# EAGLE design FMBTECH (EAGLE 8.5.0)
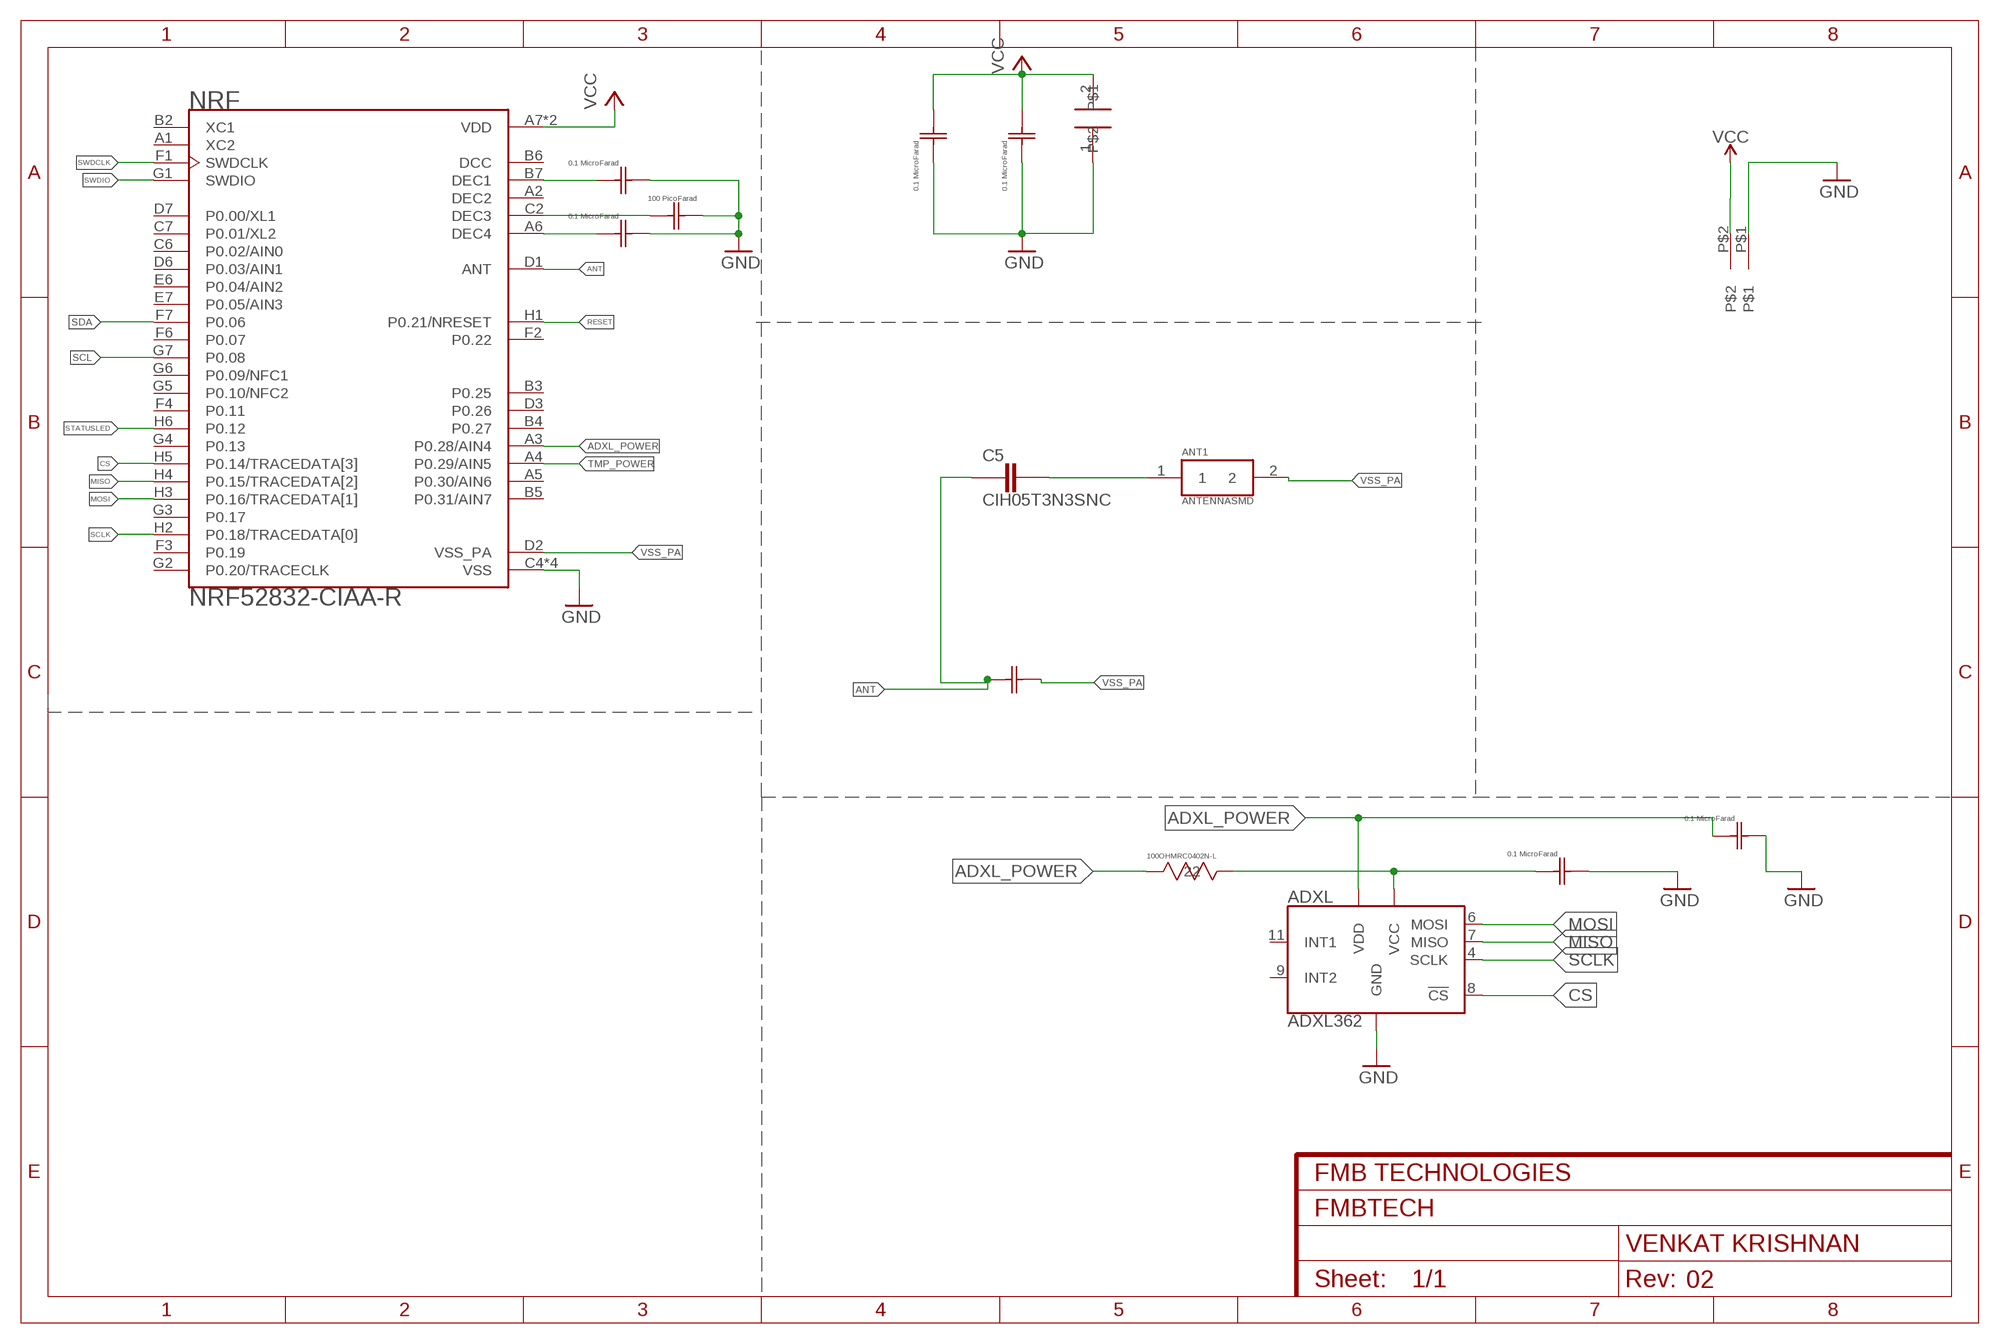
[diagram p0: schematic, sheet 1]

## Parts
ADXL  ADXL362  [TFLGA-16/3.3MMX3.1MM]
ANT1  ANTENNASMD  [1]
C1  02016D104KAT2A  [0201]
C2  02016D104KAT2A  [0201]
C3  GRM0335C1E101JA01D  [G-033]
C4  GJM1555C1H1R0BB01DG-155-L  [G-155-L]
C5  CIH05T3N3SNC  [CAPC1005X55N]
C6  02016D104KAT2A  [0201]
C7  02016D104KAT2A  [0201]
C8  02016D104KAT2A  [0201]
C9  02016D104KAT2A  [0201]
NRF  NRF52832-CIAA-R  [BGA50N40P7X8_300X320X40]
R6  100OHMRC0402N-L  [RES]
U$1  4.7µF  [CAP]
U$4  SUPPLY  [SUPPLY]

## Nets
ADXL_POWER: ADXL.1(VDD) C9.1 NRF.A3(P0.28/AIN4) R6.1
ANT: C4.1 C5.1 NRF.D1(ANT)
CS: ADXL.8(!CS) NRF.H5(P0.14/TRACEDATA[3])
GND: ADXL.12(GND) ADXL.13(GND) ADXL.16(GND) C1.2 C2.2 C3.2 C6.1 C7.1 C8.2 C9.2 NRF.C4(VSS) NRF.C5(VSS) NRF.E3(VSS) NRF.F5(VSS) U$1.1 U$4.P$1
MISO: ADXL.7(MISO) NRF.H4(P0.15/TRACEDATA[2])
MOSI: ADXL.6(MOSI) NRF.H3(P0.16/TRACEDATA[1])
N$1: ANT1.1 C5.2
N$6: C2.1 NRF.A6(DEC4)
N$8: C1.1 NRF.B7(DEC1)
N$9: C3.1 NRF.C2(DEC3)
N$10: ADXL.14(VCC) C8.1 R6.2
RESET: NRF.H1(P0.21/NRESET)
SCL: NRF.G7(P0.08)
SCLK: ADXL.4(SCLK) NRF.H2(P0.18/TRACEDATA[0])
SDA: NRF.F7(P0.06)
STATUSLED: NRF.H6(P0.12)
SWDCLK: NRF.F1(SWDCLK)
SWDIO: NRF.G1(SWDIO)
TMP_POWER: NRF.A4(P0.29/AIN5)
VCC: C6.2 C7.2 NRF.A7(VDD) NRF.H7(VDD) U$1.2 U$4.P$2
VSS_PA: ANT1.2 C4.2 NRF.D2(VSS_PA)
Unconnected: ADXL.9(INT2) ADXL.11(INT1) NRF.A1(XC2) NRF.A5(P0.30/AIN6) NRF.B2(XC1) NRF.B3(P0.25) NRF.B4(P0.27) NRF.B5(P0.31/AIN7) NRF.C6(P0.02/AIN0) NRF.C7(P0.01/XL2) NRF.D3(P0.26) NRF.D6(P0.03/AIN1) NRF.D7(P0.00/XL1) NRF.E6(P0.04/AIN2) NRF.E7(P0.05/AIN3) NRF.F2(P0.22) NRF.F3(P0.19) NRF.F4(P0.11) NRF.F6(P0.07) NRF.G2(P0.20/TRACECLK) NRF.G3(P0.17) NRF.G4(P0.13) NRF.G5(P0.10/NFC2) NRF.G6(P0.09/NFC1)

## Power pins joined to a net without a drawn wire
DCC: NRF.B6(DCC)
DEC2: NRF.A2(DEC2)

## Library data of the parts
ADXL = ADXL362:ADXL362: IC ACCEL DIG LO PWR 3AX 16LGA; AVAILABILITY: Good; DESCRIPTION: Accelerometer Triple ±2/±4/±8g 1.6V to 3.6V 16-Pin LGA T/R; MF: Analog Devices; MP: ADXL362BCCZ-RL7; PACKAGE: LGA-16 Analog Devices; PRICE: 6.52 USD
ANT1 = antenna:ANTENNA; AVAILABILITY: Good; DESCRIPTION: Bluetooth/WLAN/WiFi Ceramic Chip Antenna 3-Pin SMD; MF: Pulse; MP: W3008; PACKAGE: None; PRICE: 0.93 USD
C1 C2 C6-C9 = cap_1microfarad:02016D104KAT2A; MANUFACTURER_PART_NUMBER: 02016D104KAT2A; VENDOR: AVX Corporation
C3 = cap_100picofarad:GRM0335C1E101JA01D; MANUFACTURER_PART_NUMBER: GRM0335C1E101JA01D; VENDOR: Murata
C4 = 1pfcap:GJM1555C1H1R0BB01D; MANUFACTURER_PART_NUMBER: GJM1555C1H1R0BB01D; VENDOR: Murata
C5 = 3.3nh_inductor:CIH05T3N3SNC: FIXED IND 3.3NH 300MA 190 MOHM; AVAILABILITY: Good; DESCRIPTION: Ind High Frequency Chip Multi-Layer 3.3nH 0.3nH 100MHz 8Q-Factor Ceramic 300mA 0402 Paper T/R; MF: Samsung; MP: CIH05T3N3SNC; PACKAGE: 0402 Samsung; PRICE: 0.01 USD
NRF = NRF52832-CIAA-R:NRF52832-CIAA-R: Multi Protocal Bluetooth Smart ANT 2.4GHz RF SoC (WL-CSP); AVAILABILITY: Good; DESCRIPTION: Multi Protocal Bluetooth Smart ANT 2.4GHz RF SoC (WL-CSP); MF: Nordic; MP: NRF52832-CIAA-R; PACKAGE: XFBGA-50 Nordic Semiconductor; PRICE: 3.75 USD
R6 = 100ohm:100OHM; MANUFACTURER_PART_NUMBER: RC0402FR07100RL; VENDOR: Yageo
U$1 = 4p7microfarad:4.7µF
U$4 = supply:SUPPLY

## Board
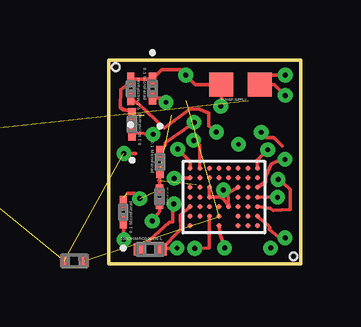
[diagram p1: board, top side]
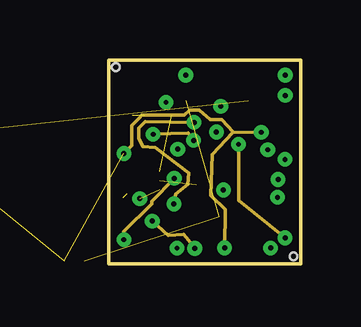
[diagram p2: board, inner layer Route4]
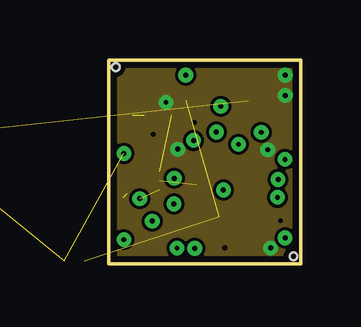
[diagram p3: board, inner layer Route8]
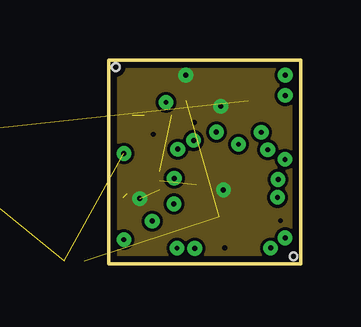
[diagram p4: board, inner layer Route10]
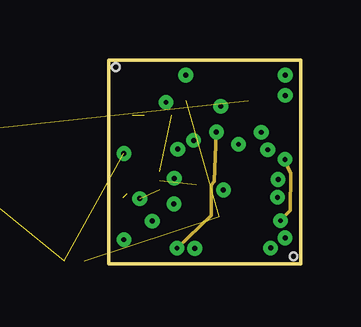
[diagram p5: board, inner layer Route12]
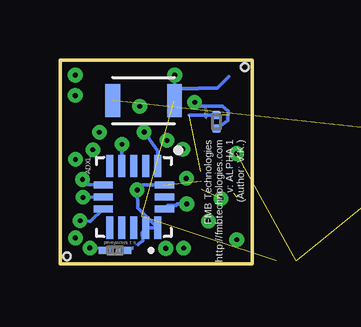
[diagram p6: board, bottom side, seen from below]

Size 8 x 8.5 mm. Coordinates in mm from the lower left corner, seen from the top.
Outline: 0,0 8,0 8,8.5 0,8.5 0,0
Copper layers (((1*4)*8*10)*(12*16)): Top 0.035mm / dielectric 1.15mm / Route4 0.035mm / dielectric 0.15mm / Route8 0.035mm / dielectric 0.15mm / Route10 0.035mm / dielectric 0.15mm / Route12 0.035mm / dielectric 0.2mm / Bottom 0.035mm
Design rules "default *": minimum track width 6mil, minimum drill 8mil, track to track 5mil, track to pad 5mil, pad to pad 5mil, via to via 5mil, smd to smd 2mil, copper to edge 10mil, drill to drill 10mil, minimum pad ring 10mil, minimum via ring 8mil, stop-mask expansion 4mil, vias tented up to drill 0mil, thermal gap 10mil
Holes 0.3 mm at 0.3,8.2 7.7,0.3

### Footprints (pad centres in the part's own frame; a part is rotated, then mirrored left to right if it is on the bottom)
TFLGA-16/3.3MMX3.1MM = smd 0.925 x 0.3: 1 -1.288,1; 2 -1.288,0.5; 3 -1.288,0; 4 -1.288,-0.5; 5 -1.288,-1; 9 1.288,-1; 10 1.288,-0.5; 11 1.288,0; 12 1.288,0.5; 13 1.288,1 | smd 0.3 x 0.8: 6 -0.5,-1.275; 7 0,-1.275; 8 0.5,-1.275; 14 0.5,1.275; 15 0,1.275; 16 -0.5,1.275
1 = smd 0.62 x 1.36: 1 0,0; 2 2.58,0
0201 = smd 0.559 x 0.305: 1 -0.394,0; 2 0.394,0
G-033 = smd 0.406 x 0.305: 1 -0.305,0; 2 0.305,0
G-155-L = smd 0.356 x 0.508: 1 -0.419,0; 2 0.419,0
CAPC1005X55N = smd 0.54 x 0.6: 1 -0.43,0; 2 0.43,0
BGA50N40P7X8_300X320X40 = smd 0.2 x 0.2: A1 -1.2,1.4; A2 -0.8,1.4; A3 -0.4,1.4; A4 0,1.4; A5 0.4,1.4; A6 0.8,1.4; A7 1.2,1.4; B2 -0.8,1; B3 -0.4,1; B4 0,1; B5 0.4,1; B6 0.8,1; B7 1.2,1; C2 -0.8,0.6; C3 -0.4,0.6; C4 0,0.6; C5 0.4,0.6; C6 0.8,0.6; C7 1.2,0.6; D1 -1.2,0.2; D2 -0.8,0.2; D3 -0.4,0.2; D6 0.8,0.2; D7 1.2,0.2; E3 -0.4,-0.2; E6 0.8,-0.2; E7 1.2,-0.2; F1 -1.2,-0.6; F2 -0.8,-0.6; F3 -0.4,-0.6; F4 0,-0.6; F5 0.4,-0.6; F6 0.8,-0.6; F7 1.2,-0.6; G1 -1.2,-1; G2 -0.8,-1; G3 -0.4,-1; G4 0,-1; G5 0.4,-1; G6 0.8,-1; G7 1.2,-1; H1 -1.2,-1.4; H2 -0.8,-1.4; H3 -0.4,-1.4; H4 0,-1.4; H5 0.4,-1.4; H6 0.8,-1.4; H7 1.2,-1.4
RES = smd 0.457 x 0.508: 1 -0.457,0; 2 0.457,0
CAP = smd 0.34 x 0.36: 1 -0.28,0; 2 0.28,0
SUPPLY = smd 1 x 1: P$1 0,0; P$2 1.6,0

### Placement (x,y rotation side)
ADXL  4.92,2.78 270 bottom
ANT1  5.81,6.8 0 bottom
C1  0.98,5.81 90 top
C2  0.61,2.15 90 top
C3  2.12,2.78 90 top
C4  -1.43,0.12 0 top
C5  -7.87,5.36 0 top  (outside the outline)
C6  5.71,0.55 180 bottom
C7  1.82,7.3 270 top
C8  2.14,4.24 270 top
C9  0.92,7.29 90 top
NRF  4.8,2.78 90 top
R6  1.73,0.6 180 top
U$1  1.48,5.91 270 bottom
U$4  4.69,7.48 0 top

### Tracks (layer width: path | path; a pad name or v marks a point on that pad's centre or on a via)
ADXL_POWER  (via drill 0.2 pad 0.46)
  Top 0.152: NRF.A3 2.99,2.03 3.01,1.42 R6.1 2.33,0.64 v2.85,0.64 | 0.84,6.82 C9.1 1.16,6.72 1.24,6.68 2.33,5.66 3.38,6.45 3.78,6.45 4.17,6.28 4.17,5.73 v4.49,5.49
  Route12 0.152: v4.49,5.49 4.4,3.43 4.28,3.27 4.28,2.01 v2.85,0.64
  Bottom 0.152: v4.49,5.49 3.92,4.71 ADXL.1
ANT  (via drill 0.2, 0.2 layers 1-4)  (2 unrouted)
  Top 0.152: v6.36,5.48 6.57,5.27 6.87,5.27 7.23,4.92 | v4.83,0.66 4.63,1.28 NRF.D1 | 1.14,4.6 v0.64,4.6
  Route4 0.152: 6.34,5.46 v6.36,5.48 5.18,5.5 | v0.64,4.6 0.96,4.92 0.96,5.75 1.04,5.82 1.25,6.05 1.32,6.12 1.39,6.2 1.4,6.2 1.5,6.2 1.6,6.2 3.14,6.2 3.38,6.41 3.78,6.41 4.25,6.02 4.72,6.02 5.18,5.5 | 5.18,5.5 5.17,5.46 4.32,4.55 4.25,2.85 4.86,2.26 v4.83,0.66
CS  (via drill 0.2 pad 0.46, 0.2 pad 0.46 layers 12-16)
  Top 0.152: v7.35,4.35 7.08,4.29 6.79,4.15 6.54,3.63 6.55,3.4 NRF.H5
  Route12 0.152: v7.35,4.35 7.47,4.03 7.58,3.75 7.56,2.22 v7.16,1.79
  Bottom 0.152: ADXL.8 6.73,1.75 v7.16,1.79
GND  (via drill 0.2 pad 0.46)  (5 unrouted)
  Top 0.152: v4.68,6.56 4.69,6.58 U$4.P$1 3.6,7.48 v3.22,7.87 2.99,8.09 2.22,8.09 C7.1 0.93,7.7 C9.2 0.92,7.58 0.52,7.26 0.48,6.51 0.66,6.4 0.79,6.41 C1.2 | 2.12,3.44 C3.2 | 2.12,3.44 2.12,3.83 C8.2 | NRF.C5 NRF.C4 4.6,2.78 4.78,2.72 | 4.78,2.72 NRF.E3 4.97,2.95 NRF.F5 | 4.78,2.72 4.69,3 v4.78,3.07 | C2.2 0.61,2.76 | 2.09,3.47 2.12,3.44 | 0.77,2.92 1.09,2.92 v1.3,2.71
  Route10 0.152: v4.68,6.56 4.68,6.54 4.67,6.54 | v4.78,3.07 4.77,3.09 4.78,3.09
  Bottom 0.152: 3.22,7.23 v3.22,7.87 3.23,7.85 | 3.22,7.23 3.22,6.81 | U$1.1 2.62,6.19 | 0.97,7.79 1.45,7.31 2.22,7.31 2.23,7.31 3.15,7.31 3.22,7.23 | 4.4,1.5 ADXL.12 | 4.4,1.5 ADXL.13 4.76,2.33 v4.78,3.07 4.55,3.28 ADXL.16 | 4.4,1.5 4.57,1.3 4.56,0.94 4.69,0.84 4.87,0.68 C6.1
  pour Route10: 0,0 8,0 8,8.5 0,8.5
MISO  (via drill 0.2 pad 0.46)
  Top 0.152: v7.04,2.76 ADXL.7
  Bottom 0.152: ADXL.7 7.06,2.75 v7.04,2.76
MOSI  (via drill 0.2 pad 0.46)
  Top 0.152: v7.06,3.51 7.24,3.4 7.28,3.37 7.57,3.09 7.58,2.6 7.57,2.25 6.86,2.22 6.74,2.3 NRF.H3
  Bottom 0.152: v7.06,3.51 6.83,3.29 ADXL.6
N$1  (1 unrouted)
N$6  (via drill 0.2 pad 0.46)
  Top 0.152: C2.1 0.64,1.73 v0.64,1 | v2.74,3.56 2.76,3.58 NRF.A6
  Route4 0.152: v2.74,3.56 1.8,2.6 1.81,2.48 0.64,1.34 v0.64,1
N$8  (via drill 0.2 pad 0.46, 0.2 pad 0.46 layers 1-4)
  Top 0.152: C1.1 1.09,5.45 v1.85,5.4 | v3.54,5.14 3.8,4.96 NRF.B7
  Route4 0.152: v1.85,5.4 3.31,5.45 v3.54,5.14
N$9  (via drill 0.2)
  Top 0.152: NRF.C2 4.2,0.66 v3.59,0.64 | v1.82,1.78 2.12,2.17 C3.1
  Route4 0.152: v3.59,0.64 3.6,0.66 3.13,1.22 2.49,1.18 v1.82,1.78
N$10  (via drill 0.2 layers 1-4, 0.2 pad 0.46)
  Top 0.152: R6.2 2.52,1.72 2.68,1.75 2.68,2.43 v2.72,2.49 | C8.1 2.37,4.95 2.37,5.03 2.47,5.11 v3.56,5.89
  Route4 0.152: v3.56,5.89 1.52,5.92 1.26,5.65 1.25,5.24 1.43,4.89 1.94,4.84 3.34,3.79 3.29,3.3 2.79,2.91 v2.72,2.49
  Bottom 0.152: v2.72,2.49 3.1,2.49 3.17,2.43 3.5,2.43 ADXL.14
SCLK  (via drill 0.2 pad 0.46)
  Top 0.152: NRF.H2 6.66,1.6 6.71,1.51 6.69,1.43 7.06,1.11 v7.36,1.07
  Route4 0.152: v7.36,1.07 5.41,2.64 v5.41,4.98
  Bottom 0.152: v5.41,4.98 5.42,4.97 ADXL.4
VCC  (via drill 0.2, 0.2 pad 0.46)
  Top 0.152: NRF.H7 6.2,4.31 v6.63,4.75 | NRF.A7 3.4,4.26 v2.88,4.78 | C7.2 2.15,6.91 v2.39,6.73 | v7.36,7.87 6.68,7.87 U$4.P$2 6.9,7.48 v7.36,7.01
  Route8 0.152: v7.36,7.87 v7.36,7.88 | v6.75,0.65 6.76,0.61 6.75,0.64
  Bottom 0.152: U$1.2 1.48,5.65 1.02,5.97 0.98,6.37 1.24,6.58 2.32,6.57 v2.39,6.73 | C6.2 6.25,0.64 v6.75,0.65
  pour Route8: 0,0 8,0 8,8.5 0,8.5
VSS_PA  (2 unrouted)

### Text on the board
bNames: FMB Technologies / http://fmbtechnologies.com / v: ALPHA 1 / (Author: V.K.)